# EAGLE design PIO-Breakout (EAGLE 9.5.2)
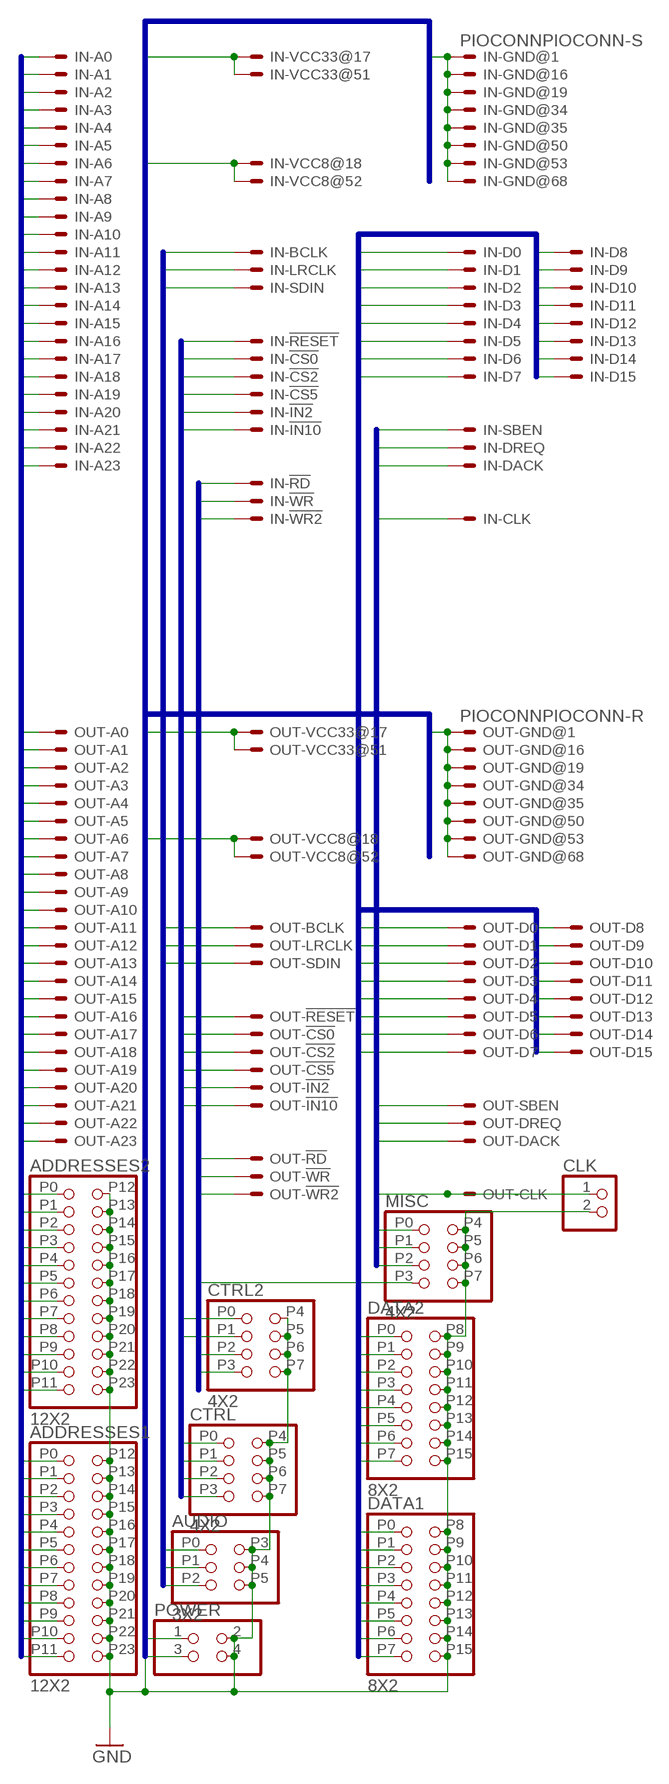
[diagram p0: schematic, sheet 1]

## Parts
ADDRESSES1  12X2  [12X2]
ADDRESSES2  12X2  [12X2]
AUDIO  3X2  [3X2]
CLK  PINHD-1X2  [1X02]
CTRL  4X2  [4X2]
CTRL2  4X2  [4X2]
DATA1  8X2  [8X2]
DATA2  8X2  [8X2]
IN  PIOCONNPIOCONN-S  [PIOCONN]
MISC  4X2  [4X2]
OUT  PIOCONNPIOCONN-R  [PIOCONN-R]
POWER  PINHD-2X2  [2X02]

## Nets
+3V3: IN.17 IN.51 OUT.17 OUT.51 POWER.3
+8V: IN.18 IN.52 OUT.18 OUT.52 POWER.1
A0: ADDRESSES1.P11 IN.14 OUT.14
A1: ADDRESSES2.P11 IN.48 OUT.48
A2: ADDRESSES1.P10 IN.15 OUT.15
A3: ADDRESSES2.P10 IN.49 OUT.49
A4: ADDRESSES1.P9 IN.20 OUT.20
A5: ADDRESSES2.P9 IN.54 OUT.54
A6: ADDRESSES1.P8 IN.21 OUT.21
A7: ADDRESSES2.P8 IN.55 OUT.55
A8: ADDRESSES1.P7 IN.22 OUT.22
A9: ADDRESSES2.P7 IN.56 OUT.56
A10: ADDRESSES1.P6 IN.23 OUT.23
A11: ADDRESSES2.P6 IN.57 OUT.57
A12: ADDRESSES1.P5 IN.24 OUT.24
A13: ADDRESSES2.P5 IN.58 OUT.58
A14: ADDRESSES1.P4 IN.25 OUT.25
A15: ADDRESSES2.P4 IN.59 OUT.59
A16: ADDRESSES1.P3 IN.26 OUT.26
A17: ADDRESSES2.P3 IN.60 OUT.60
A18: ADDRESSES1.P2 IN.27 OUT.27
A19: ADDRESSES2.P2 IN.61 OUT.61
A20: ADDRESSES1.P1 IN.28 OUT.28
A21: ADDRESSES2.P1 IN.62 OUT.62
A22: ADDRESSES1.P0 IN.29 OUT.29
A23: ADDRESSES2.P0 IN.63 OUT.63
BCLK: AUDIO.P2 IN.33 OUT.33
CLK: CLK.1 IN.32 OUT.32
CS0: CTRL.P0 IN.4 OUT.4
CS2: CTRL.P1 IN.39 OUT.39
CS5: CTRL2.P0 IN.65 OUT.65
D0: DATA1.P7 IN.6 OUT.6
D1: DATA2.P7 IN.40 OUT.40
D2: DATA1.P6 IN.7 OUT.7
D3: DATA2.P6 IN.41 OUT.41
D4: DATA1.P5 IN.8 OUT.8
D5: DATA2.P5 IN.42 OUT.42
D6: DATA1.P4 IN.9 OUT.9
D7: DATA2.P4 IN.43 OUT.43
D8: DATA1.P3 IN.10 OUT.10
D9: DATA2.P3 IN.44 OUT.44
D10: DATA1.P2 IN.11 OUT.11
D11: DATA2.P2 IN.45 OUT.45
D12: DATA1.P1 IN.12 OUT.12
D13: DATA2.P1 IN.46 OUT.46
D14: DATA1.P0 IN.13 OUT.13
D15: DATA2.P0 IN.47 OUT.47
DACK: IN.36 MISC.P1 OUT.36
DREQ: IN.3 MISC.P2 OUT.3
GND: ADDRESSES1.P12 ADDRESSES1.P13 ADDRESSES1.P14 ADDRESSES1.P15 ADDRESSES1.P16 ADDRESSES1.P17 ADDRESSES1.P18 ADDRESSES1.P19 ADDRESSES1.P20 ADDRESSES1.P21 ADDRESSES1.P22 ADDRESSES1.P23 ADDRESSES2.P12 ADDRESSES2.P13 ADDRESSES2.P14 ADDRESSES2.P15 ADDRESSES2.P16 ADDRESSES2.P17 ADDRESSES2.P18 ADDRESSES2.P19 ADDRESSES2.P20 ADDRESSES2.P21 ADDRESSES2.P22 ADDRESSES2.P23 AUDIO.P3 AUDIO.P4 AUDIO.P5 CLK.2 CTRL2.P4 CTRL2.P5 CTRL2.P6 CTRL2.P7 CTRL.P4 CTRL.P5 CTRL.P6 CTRL.P7 DATA1.P8 DATA1.P9 DATA1.P10 DATA1.P11 DATA1.P12 DATA1.P13 DATA1.P14 DATA1.P15 DATA2.P8 DATA2.P9 DATA2.P10 DATA2.P11 DATA2.P12 DATA2.P13 DATA2.P14 DATA2.P15 IN.1 IN.16 IN.19 IN.34 IN.35 IN.50 IN.53 IN.68 MISC.P4 MISC.P5 MISC.P6 MISC.P7 OUT.1 OUT.16 OUT.19 OUT.34 OUT.35 OUT.50 OUT.53 OUT.68 POWER.2 POWER.4
IN2: CTRL2.P1 IN.31 OUT.31
IN10: CTRL.P2 IN.37 OUT.37
LRCLK: AUDIO.P1 IN.66 OUT.66
RD: CTRL2.P2 IN.30 OUT.30
RESET: CTRL.P3 IN.2 OUT.2
SBEN: IN.5 MISC.P0 OUT.5
SDIN: AUDIO.P0 IN.67 OUT.67
WR: CTRL2.P3 IN.64 OUT.64
WR2: IN.38 MISC.P3 OUT.38

## Buses
A0,A1,A2,A3,A4,A5,A6,A7,A8,A9,A10,A11,A12,A13,A14,A15,A16,A17,A18,A19,A20,A21,A22,A23
+3V3,+8V,GND
BCLK,LRCLK,SDIN
CS0,CS2,CS5,IN2,IN10,RESET
RD,WR,WR2
D0,D1,D2,D3,D4,D5,D6,D7,D8,D9,D10,D11,D12,D13,D14,D15
CLK,DACK,DREQ,SBEN

## Library data of the parts
ADDRESSES1 ADDRESSES2 = pixel:12X2
AUDIO = pixel:3X2
CLK = pinhead:PINHD-1X2: PIN HEADER
CTRL CTRL2 MISC = pixel:4X2
DATA1 DATA2 = pixel:8X2
IN = pixel:PIOCONN: CONNECTOR 68-pin 1.27mm (.050 inch) pitch SCSI+ unshielded receptacle right angle all plastic
OUT = pixel:PIOCONN: CONNECTOR 68-pin 1.27mm (.050 inch) pitch SCSI+ unshielded receptacle right angle all plastic; MF: MOLEX; OC_FARNELL: unknown; OC_NEWARK: unknown
POWER = pinhead:PINHD-2X2: PIN HEADER

## Board
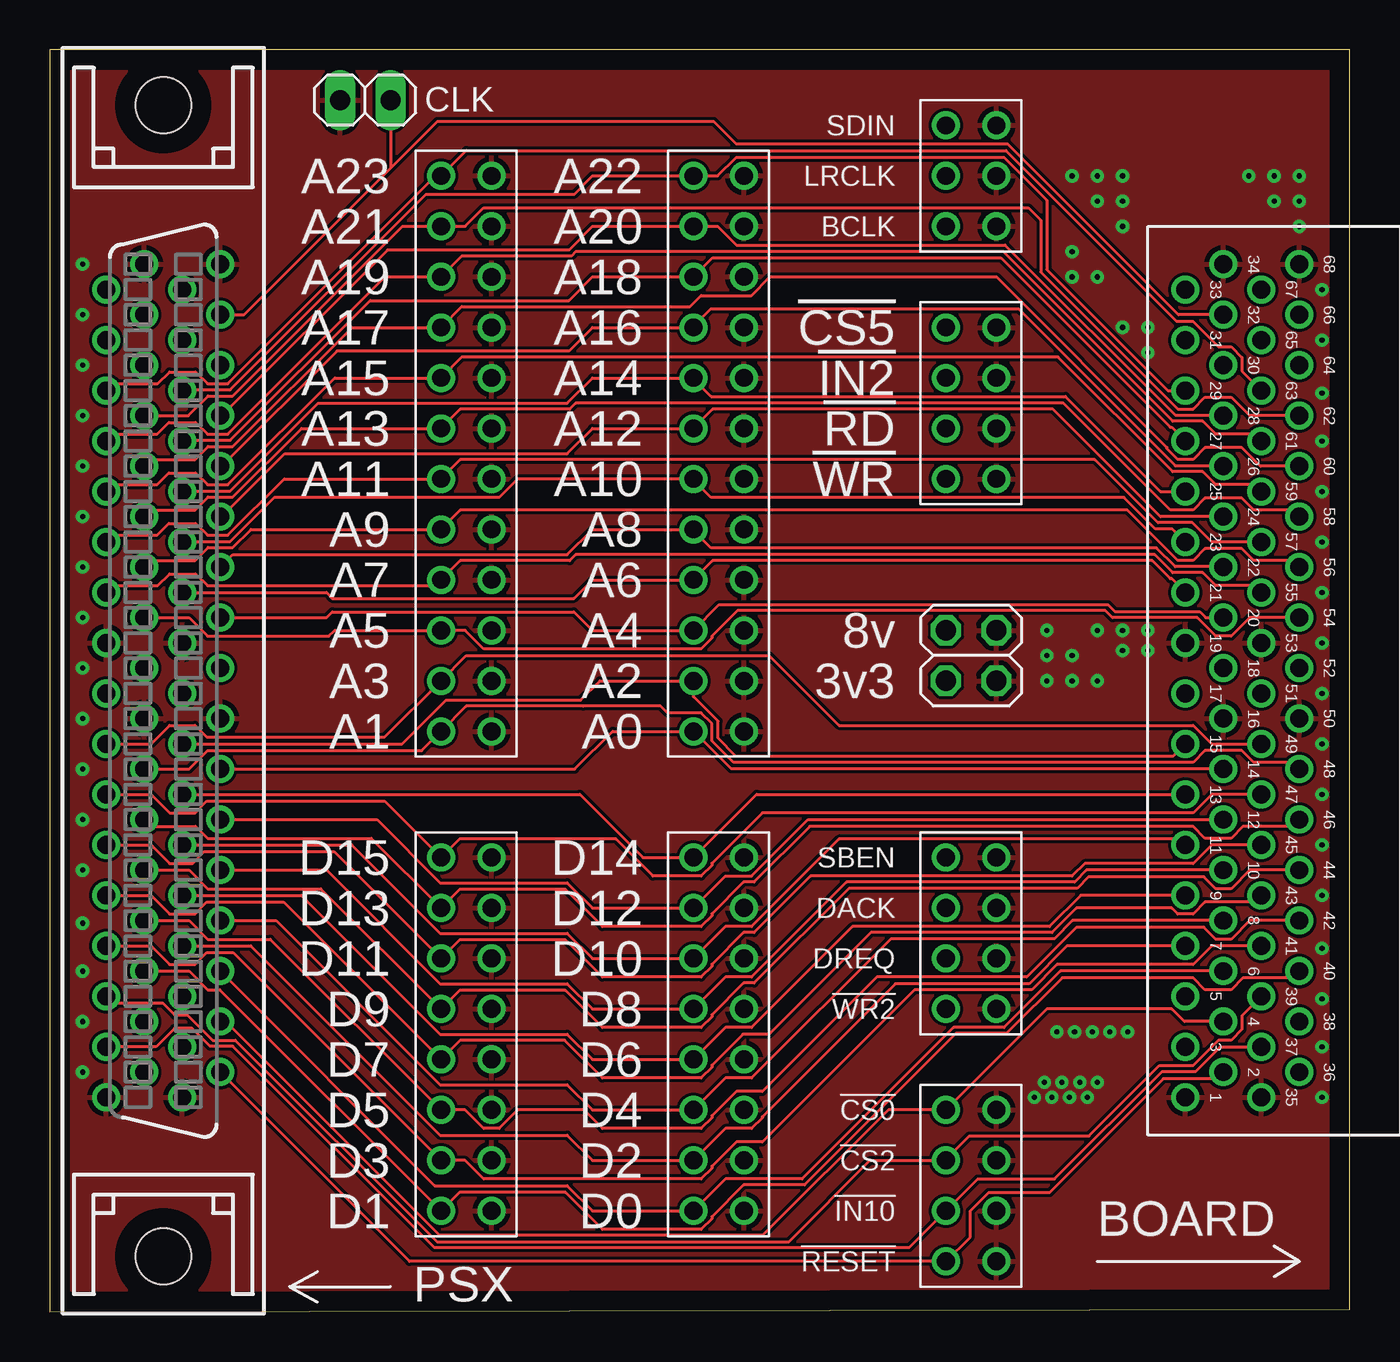
[diagram p1: board, top side]
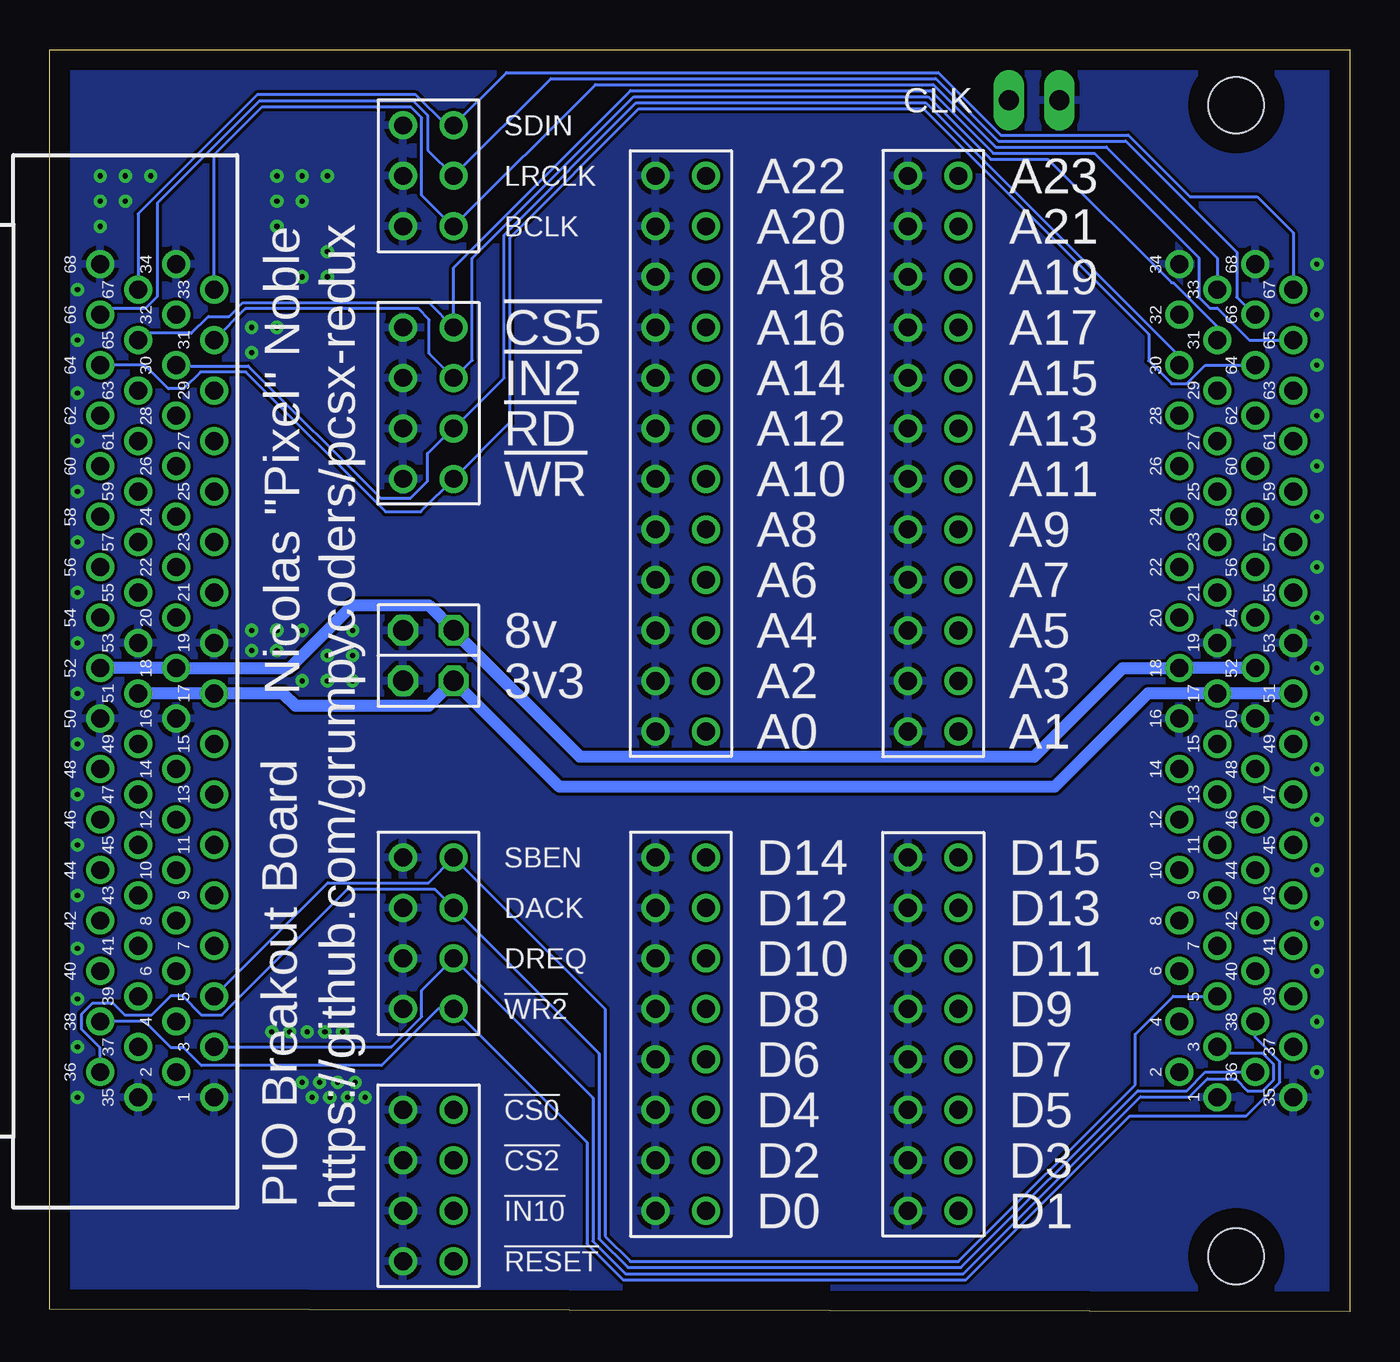
[diagram p2: board, bottom side, seen from below]

Size 65.41 x 63.5 mm. Coordinates in mm from the lower left corner, seen from the top.
Outline: 0,0 65.41,0.13 65.41,63.5 0,63.5 0,0
Copper layers (1*16): Top 0.035mm / dielectric 1.5mm / Bottom 0.035mm
Design rules "default *": minimum track width 6mil, minimum drill 10mil, track to track 6mil, track to pad 6mil, pad to pad 6mil, via to via 6mil, smd to smd 6mil, copper to edge 40mil, drill to drill 6mil, minimum pad ring 10mil, minimum via ring 8mil, stop-mask expansion 4mil, vias tented up to drill 25mil, thermal gap 10mil

### Footprints (pad centres in the part's own frame; a part is rotated, then mirrored left to right if it is on the bottom)
12X2 = drill 0.9 pad 1.27: P0 -1.27,13.97; P1 -1.27,11.43; P2 -1.27,8.89; P3 -1.27,6.35; P4 -1.27,3.81; P5 -1.27,1.27; P6 -1.27,-1.27; P7 -1.27,-3.81; P8 -1.27,-6.35; P9 -1.27,-8.89; P10 -1.27,-11.43; P11 -1.27,-13.97; P12 1.27,-13.97; P13 1.27,-11.43; P14 1.27,-8.89; P15 1.27,-6.35; P16 1.27,-3.81; P17 1.27,-1.27; P18 1.27,1.27; P19 1.27,3.81; P20 1.27,6.35; P21 1.27,8.89; P22 1.27,11.43; P23 1.27,13.97
3X2 = drill 0.9 pad 1.27: P0 -1.27,2.54; P1 -1.27,0; P2 -1.27,-2.54; P3 1.27,-2.54; P4 1.27,0; P5 1.27,2.54
1X02 = drill 1.016 long: 1 -1.27,0; 2 1.27,0
4X2 = drill 0.9 pad 1.27: P0 -1.27,3.81; P1 -1.27,1.27; P2 -1.27,-1.27; P3 -1.27,-3.81; P4 1.27,-3.81; P5 1.27,-1.27; P6 1.27,1.27; P7 1.27,3.81
8X2 = drill 0.9 pad 1.27: P0 -1.27,8.89; P1 -1.27,6.35; P2 -1.27,3.81; P3 -1.27,1.27; P4 -1.27,-1.27; P5 -1.27,-3.81; P6 -1.27,-6.35; P7 -1.27,-8.89; P8 1.27,-8.89; P9 1.27,-6.35; P10 1.27,-3.81; P11 1.27,-1.27; P12 1.27,1.27; P13 1.27,3.81; P14 1.27,6.35; P15 1.27,8.89
PIOCONN = drill 0.9 pad 1.27: 1 20.955,0.953; 2 19.685,2.863; 3 18.415,0.953; 4 17.145,2.863; 5 15.875,0.953; 6 14.605,2.863; 7 13.335,0.953; 8 12.065,2.863; 9 10.795,0.953; 10 9.525,2.863; 11 8.255,0.953; 12 6.985,2.863; 13 5.715,0.953; 14 4.445,2.863; 15 3.175,0.953; 16 1.905,2.863; 17 0.635,0.953; 18 -0.635,2.863; 19 -1.905,0.953; 20 -3.175,2.863; 21 -4.445,0.953; 22 -5.715,2.863; 23 -6.985,0.953; 24 -8.255,2.863; 25 -9.525,0.953; 26 -10.795,2.863; 27 -12.065,0.953; 28 -13.335,2.863; 29 -14.605,0.953; 30 -15.875,2.863; 31 -17.145,0.953; 32 -18.415,2.863; 33 -19.685,0.953; 34 -20.955,2.863; 35 20.955,-2.867; 36 19.685,-0.957; 37 18.415,-2.867; 38 17.145,-0.957; 39 15.875,-2.867; 40 14.605,-0.957; 41 13.335,-2.867; 42 12.065,-0.957; 43 10.795,-2.867; 44 9.525,-0.957; 45 8.255,-2.867; 46 6.985,-0.957; 47 5.715,-2.867; 48 4.445,-0.957; 49 3.175,-2.867; 50 1.905,-0.957; 51 0.635,-2.867; 52 -0.635,-0.957; 53 -1.905,-2.867; 54 -3.175,-0.957; 55 -4.445,-2.867; 56 -5.715,-0.957; 57 -6.985,-2.867; 58 -8.255,-0.957; 59 -9.525,-2.867; 60 -10.795,-0.957; 61 -12.065,-2.867; 62 -13.335,-0.957; 63 -14.605,-2.867; 64 -15.875,-0.957; 65 -17.145,-2.867; 66 -18.415,-0.957; 67 -19.685,-2.867; 68 -20.955,-0.957 | hole 2.8: -28.955,0; 28.955,0
PIOCONN-R = drill 0.9 pad 1.27: 1 -20.955,-5.73; 2 -19.685,-3.82; 3 -18.415,-5.73; 4 -17.145,-3.82; 5 -15.875,-5.73; 6 -14.605,-3.82; 7 -13.335,-5.73; 8 -12.065,-3.82; 9 -10.795,-5.73; 10 -9.525,-3.82; 11 -8.255,-5.73; 12 -6.985,-3.82; 13 -5.715,-5.73; 14 -4.445,-3.82; 15 -3.175,-5.73; 16 -1.905,-3.82; 17 -0.635,-5.73; 18 0.635,-3.82; 19 1.905,-5.73; 20 3.175,-3.82; 21 4.445,-5.73; 22 5.715,-3.82; 23 6.985,-5.73; 24 8.255,-3.82; 25 9.525,-5.73; 26 10.795,-3.82; 27 12.065,-5.73; 28 13.335,-3.82; 29 14.605,-5.73; 30 15.875,-3.82; 31 17.145,-5.73; 32 18.415,-3.82; 33 19.685,-5.73; 34 20.955,-3.82; 35 -20.955,-1.91; 36 -19.685,0; 37 -18.415,-1.91; 38 -17.145,0; 39 -15.875,-1.91; 40 -14.605,0; 41 -13.335,-1.91; 42 -12.065,0; 43 -10.795,-1.91; 44 -9.525,0; 45 -8.255,-1.91; 46 -6.985,0; 47 -5.715,-1.91; 48 -4.445,0; 49 -3.175,-1.91; 50 -1.905,0; 51 -0.635,-1.91; 52 0.635,0; 53 1.905,-1.91; 54 3.175,0; 55 4.445,-1.91; 56 5.715,0; 57 6.985,-1.91; 58 8.255,0; 59 9.525,-1.91; 60 10.795,0; 61 12.065,-1.91; 62 13.335,0; 63 14.605,-1.91; 64 15.875,0; 65 17.145,-1.91; 66 18.415,0; 67 19.685,-1.91; 68 20.955,0
2X02 = drill 1.016 octagon: 1 -1.27,-1.27; 2 -1.27,1.27; 3 1.27,-1.27; 4 1.27,1.27

### Placement (x,y rotation side)
ADDRESSES1  33.66,43.18 0 top
ADDRESSES2  20.96,43.18 0 top
AUDIO  46.35,57.15 0 top
CLK  15.88,60.96 180 top
CTRL  46.35,6.35 0 top
CTRL2  46.35,45.72 0 top
DATA1  33.66,13.97 0 top
DATA2  20.96,13.97 0 top
IN  5.71,31.75 270 top
MISC  46.35,19.05 0 top
OUT  62.86,31.75 90 bottom
POWER  46.35,33.02 270 top

### Tracks (layer width: path | path; a pad name or v marks a point on that pad's centre or on a via)
+3V3
  Bottom 0.61: IN.51 IN.17 10.16,31.11 14.86,26.42 39.75,26.42 POWER.3 46.33,30.5 53.04,30.5 53.65,31.11 OUT.17 OUT.51
+8V
  Bottom 0.61: IN.52 IN.18 11.43,32.38 15.88,27.94 38.73,27.94 POWER.1 46.35,35.56 50.16,35.56 53.34,32.38 OUT.18 OUT.52
A0
  Top 0.152: IN.14 26.42,27.3 28.32,29.21 ADDRESSES1.P11 32.41,29.21 33.67,27.95 34.28,27.34 59.01,27.34 OUT.14
A1
  Top 0.152: IN.48 7,27.3 7.94,28.24 18.71,28.24 ADDRESSES2.P11 20.95,30.47 26.84,30.47 26.85,30.48 30.73,30.48 31.07,30.14 32.77,30.14 33.32,29.6 33.32,28.73 34.41,27.64 57.52,27.64 58.12,28.24 59.97,28.24 60.57,27.64 62.53,27.64 OUT.48
A2
  Top 0.152: IN.15 17.73,28.57 19.93,30.78 26.71,30.78 27.69,31.75 ADDRESSES1.P10 32.38,30.96 33.62,29.72 33.62,28.86 34.54,27.95 56.51,27.95 OUT.15
A3
  Top 0.152: IN.49 5.09,28.57 6.03,29.51 7.31,29.51 7.9,28.91 16.85,28.91 ADDRESSES2.P10 20.96,33.02 36.2,33.02 39.71,29.51 57.52,29.51 58.45,28.57 OUT.49
A4
  Top 0.152: IN.20 13.92,34.92 14.22,35.22 26.37,35.22 27.31,34.29 ADDRESSES1.P9 33.68,35.59 53.24,35.59 53.6,35.23 57.85,35.23 58.16,34.92 OUT.20
A5
  Top 0.152: IN.54 7,34.92 7.94,33.99 14.04,33.99 14.34,34.29 ADDRESSES2.P9 20.91,34.29 21.84,33.36 32.77,33.36 33.32,33.9 33.32,34 34.6,35.28 53.11,35.28 53.47,34.92 57.73,34.92 58.66,33.99 59.43,33.99 60.36,34.92 OUT.54
A6
  Top 0.152: IN.21 13.92,36.2 14.22,35.9 26.37,35.9 27.31,36.83 ADDRESSES1.P8 33.35,37.8 55.46,37.8 56.37,36.89 56.44,36.89 OUT.21
A7
  Top 0.152: IN.55 3.18,36.53 5.43,36.53 6.03,37.13 7.34,37.13 7.94,36.53 19.38,36.53 ADDRESSES2.P8 20.65,37.8 26.16,37.8 26.47,38.1 55.59,38.1 56.5,37.19 58,37.19 58.66,36.53 60.62,36.53 OUT.55
A8
  Top 0.152: IN.22 9.21,38.1 26.04,38.1 27.31,39.37 ADDRESSES1.P7 32.38,39.32 33.27,38.44 55.68,38.44 56.62,37.5 59.01,37.5 OUT.22
A9
  Top 0.152: IN.56 5.09,37.8 7.31,37.8 7.97,38.46 9.22,38.46 10.12,39.37 ADDRESSES2.P7 20.65,40.34 54.22,40.34 56.75,37.8 57.52,37.8 58.12,38.4 59.97,38.4 60.57,37.8 62.53,37.8 OUT.56
A10
  Top 0.152: IN.23 6.7,38.77 9.09,38.77 11.3,40.98 22.61,40.98 23.54,41.91 ADDRESSES1.P6 32.38,41.86 33.27,40.98 54.04,40.98 55.63,39.4 56.48,39.4 OUT.23
A11
  Top 0.152: IN.57 3.18,39.07 5.4,39.07 5.99,39.67 7.34,39.67 7.94,39.07 8.96,39.07 11.8,41.91 ADDRESSES2.P6 20.65,42.88 52.58,42.88 55.75,39.7 57.49,39.7 58.45,38.73 OUT.57
A12
  Top 0.152: IN.24 8.65,40.01 11.82,43.18 26.04,43.18 27.31,44.45 ADDRESSES1.P5 33.35,45.41 50.47,45.41 55.88,40.01 OUT.24
A13
  Top 0.152: IN.58 5.09,40.34 7.31,40.34 7.97,41 9.22,41 12.66,44.45 ADDRESSES2.P5 20.65,45.41 26.16,45.41 26.47,45.72 51,45.72 56.38,40.34 57.52,40.34 58.12,40.94 59.97,40.94 60.57,40.34 62.53,40.34 OUT.58
A14
  Top 0.152: IN.25 6.7,41.31 9.09,41.31 13.5,45.72 26.04,45.72 27.31,46.99 ADDRESSES1.P4 32.38,46.94 33.27,46.06 51.1,46.06 55.88,41.27 OUT.25
A15
  Top 0.152: IN.59 3.18,41.61 5.4,41.61 5.99,42.21 7.34,42.21 7.94,41.61 8.96,41.61 14.34,46.99 ADDRESSES2.P4 20.73,48.04 50.73,48.04 56.5,42.27 58,42.27 58.66,41.61 60.62,41.61 OUT.59
A16
  Top 0.152: IN.26 8.65,42.55 14.45,48.34 26.12,48.34 27.31,49.53 ADDRESSES1.P3 32.38,49.58 33.27,50.46 48.74,50.46 56.62,42.58 59.01,42.58 OUT.26
A17
  Top 0.152: IN.60 5.09,42.88 7.31,42.88 7.97,43.54 9.22,43.54 15.2,49.53 ADDRESSES2.P3 20.73,50.58 32.21,50.58 32.77,51.14 35.31,51.14 36.24,52.07 47.62,52.07 56.2,43.49 56.2,43.43 56.75,42.88 57.52,42.88 58.12,43.48 59.97,43.48 60.91,42.55 OUT.60
A18
  Top 0.152: IN.27 6.7,43.85 9.09,43.85 16.13,50.88 26.12,50.88 27.31,52.07 ADDRESSES1.P2 33.35,53.03 47.84,53.03 56.37,44.51 56.44,44.51 OUT.27
A19
  Top 0.152: IN.61 3.18,44.15 5.4,44.15 5.99,44.75 7.34,44.75 7.94,44.15 8.96,44.15 16.88,52.07 ADDRESSES2.P2 20.73,53.12 26.25,53.12 26.47,53.34 47.97,53.34 56.5,44.81 58,44.81 58.66,44.15 60.62,44.15 OUT.61
A20
  Top 0.152: IN.28 8.65,45.09 16.99,53.42 26.12,53.42 27.31,54.61 ADDRESSES1.P1 33.61,54.61 34.54,53.68 48.06,53.68 56.62,45.12 59.01,45.12 OUT.28
A21
  Top 0.152: IN.62 6.97,45.09 7.97,46.08 9.22,46.08 17.74,54.61 ADDRESSES2.P1 20.91,54.61 21.84,55.54 49.23,55.54 49.86,54.91 49.86,52.31 56.75,45.42 57.52,45.42 58.12,46.02 59.43,46.02 60.36,45.09 OUT.62
A22
  Top 0.152: IN.29 6.7,46.39 9.09,46.39 18.92,56.22 26.37,56.22 27.31,57.15 ADDRESSES1.P0 33.61,57.15 34.54,58.08 48.01,58.08 50.16,55.93 50.16,52.44 56.25,46.35 OUT.29
A23
  Top 0.152: IN.63 3.18,46.69 5.43,46.69 6.03,47.29 7.34,47.29 7.94,46.69 8.96,46.69 19.42,57.15 ADDRESSES2.P0 20.96,58.42 48.1,58.42 56.7,49.83 57.52,49.83 58.79,48.56 59.43,48.56 59.98,48.01 59.98,47.33 OUT.63
BCLK
  Bottom 0.152: IN.33 6.67,53.02 12.24,58.6 17.81,58.6 20.95,61.74 37.95,61.74 AUDIO.P2 45.13,54.61 46.69,56.17 46.69,60.08 47.24,60.62 54.72,60.62 57.13,58.21 OUT.33
CLK
  Top 0.152: 17.15,57.53 9.78,50.16 IN.32 | 17.15,57.53 19.5,59.88 33.42,59.88 34.54,58.76 48.2,58.76 56.79,50.16 OUT.32 | CLK.1 17.15,57.53
CS0
  Top 0.152: IN.4 8.84,14.61 19.6,3.84 35.87,3.84 42.19,10.16 CTRL.P0 50.16,15.24 56.45,15.24 57.09,14.61 OUT.4
CS2
  Top 0.152: IN.39 3.18,15.54 5.69,15.54 6.28,14.94 6.92,14.94 8.19,13.67 9.34,13.67 19.48,3.54 37.19,3.54 41.27,7.62 CTRL.P1 45.09,7.67 46.26,8.85 52.28,8.85 55.84,12.4 57.52,12.4 58.79,13.67 59.43,13.67 59.98,14.22 59.98,14.9 OUT.39
CS5
  Bottom 0.152: OUT.65 60.62,49.23 58.28,49.23 57.43,50.08 56.38,50.08 55.69,50.77 46.32,50.77 CTRL2.P0 45.09,52.55 36.2,61.44 21.08,61.44 17.93,58.29 12.85,58.29 7.6,53.05 7.6,51.05 7.05,50.5 6.67,50.5 5.06,48.9 IN.65
D0
  Top 0.152: IN.6 19.37,6.35 26.04,6.35 27.31,5.08 DATA1.P7 33.99,6.69 37.85,6.69 45.47,14.31 48.01,14.31 50.85,17.14 OUT.6
D1
  Top 0.152: IN.40 7,17.14 7.94,16.21 8.55,16.21 DATA2.P7 20.62,6.01 25.94,6.01 27.81,4.15 32.77,4.15 33.32,4.69 33.32,4.79 34.91,6.38 37.98,6.38 45.6,14 48.14,14 50.94,16.81 57.52,16.81 58.12,16.21 59.43,16.21 60.03,16.81 62.53,16.81 OUT.40
D2
  Top 0.152: IN.7 10.11,18.41 19.64,8.89 26.04,8.89 27.31,7.62 DATA1.P6 33.99,9.23 35.31,9.23 35.86,9.77 35.86,9.82 42.54,16.51 49.28,16.51 51.18,18.41 OUT.7
D3
  Top 0.152: IN.41 5.09,18.41 6.03,17.48 7.31,17.48 7.9,18.08 9.23,18.08 DATA2.P6 20.91,7.62 21.84,6.69 32.77,6.69 33.32,7.23 33.32,7.33 34.54,8.55 35.86,8.55 43.51,16.2 49.4,16.2 50.68,17.48 57.52,17.48 58.45,18.41 OUT.41
D4
  Top 0.152: IN.8 11.38,19.68 19.64,11.43 26.04,11.43 27.31,10.16 DATA1.P5 33.99,11.77 35.31,11.77 42.32,18.78 50.55,18.78 51.46,19.68 OUT.8
D5
  Top 0.152: IN.42 7,19.68 7.94,18.75 11.09,18.75 DATA2.P5 20.91,10.16 21.84,9.23 22.61,9.23 23.54,10.16 26.87,10.16 27.81,9.23 32.77,9.23 33.32,9.77 33.32,9.87 34.54,11.09 35.86,11.09 41.61,16.85 49.15,16.85 51.66,19.35 58.06,19.35 58.66,18.75 59.43,18.75 60.36,19.68 OUT.42
D6
  Top 0.152: IN.9 12.65,20.95 19.64,13.97 26.04,13.97 27.31,12.7 DATA1.P4 33.99,14.31 35.31,14.31 40.39,19.39 50.3,19.39 51.86,20.95 OUT.9
D7
  Top 0.152: IN.43 5.09,20.95 6.03,20.02 7.31,20.02 7.9,20.62 11.77,20.62 DATA2.P4 20.65,13.66 25.91,13.66 27.81,11.77 32.77,11.77 33.32,12.31 33.32,12.41 34.88,13.97 36.2,13.97 41.31,19.08 50.42,19.08 51.66,20.32 56.45,20.32 56.75,20.02 57.52,20.02 58.12,20.62 60.62,20.62 OUT.43
D8
  Top 0.152: IN.10 13.92,22.23 19.64,16.51 26.04,16.51 27.31,15.24 DATA1.P3 33.99,16.85 35.31,16.85 40.09,21.62 51.56,21.62 52.16,22.23 OUT.10
D9
  Top 0.152: IN.44 7,22.23 7.94,21.29 13.63,21.29 DATA2.P3 20.62,16.17 25.94,16.17 27.81,14.31 32.77,14.31 33.32,14.85 33.32,14.95 34.91,16.54 35.44,16.54 40.21,21.32 51.69,21.32 52.26,21.89 58.06,21.89 58.66,21.29 59.43,21.29 60.36,22.23 OUT.44
D10
  Top 0.152: IN.11 15.19,23.5 19.64,19.05 26.04,19.05 27.31,17.78 DATA1.P2 33.99,19.39 35.31,19.39 39.72,23.79 56.77,23.79 57.07,23.5 OUT.11
D11
  Top 0.152: IN.45 5.09,23.5 6.03,22.56 7.18,22.56 7.78,23.16 14.31,23.16 DATA2.P2 20.62,18.71 25.94,18.71 27.81,16.85 32.77,16.85 33.32,17.39 33.32,17.49 34.91,19.08 35.44,19.08 38.28,21.93 51.43,21.93 52.07,22.56 57.52,22.56 58.45,23.5 OUT.45
D12
  Top 0.152: IN.12 16.46,24.77 19.64,21.59 26.04,21.59 27.31,20.32 DATA1.P1 33.99,21.93 35.31,21.93 38.15,24.77 OUT.12
D13
  Top 0.152: IN.46 5.09,24.43 7.34,24.43 7.94,23.83 16.17,23.83 DATA2.P1 20.62,21.25 25.94,21.25 27.81,19.39 32.77,19.39 33.32,19.93 33.32,20.03 34.91,21.62 35.44,21.62 38.24,24.43 57.52,24.43 58.12,23.83 59.43,23.83 60.03,24.43 62.53,24.43 OUT.46
D14
  Top 0.152: IN.13 26.67,26.04 29.85,22.86 DATA1.P0 35.56,26.04 OUT.13
D15
  Top 0.152: IN.47 5.09,26.04 6.03,25.1 7.31,25.1 7.9,25.7 16.85,25.7 DATA2.P0 20.62,23.79 28.48,23.79 30.35,21.93 32.77,21.93 33.32,22.47 33.32,22.57 35.85,25.1 57.52,25.1 58.45,26.04 OUT.47
DACK
  Bottom 0.152: OUT.36 62.86,13.29 63.8,14.22 63.8,14.99 63.25,15.54 62.23,15.54 61.63,14.94 60.28,14.94 59.3,15.92 58.75,15.92 57.77,14.94 56.75,14.94 50.44,21.25 46.02,21.25 MISC.P1 37.77,13.01 37.77,3.68 36.32,2.23 19.56,2.23 10.66,11.13 8.19,11.13 7.26,12.06 IN.36
DREQ
  Bottom 0.152: IN.3 6.33,13 4.37,13 3.83,12.45 3.83,11.68 4.37,11.13 5.14,11.13 5.74,11.73 7.17,11.73 8.06,10.83 10.54,10.83 19.43,1.93 36.45,1.93 38.07,3.56 38.07,10.77 MISC.P2 46.69,16.17 46.69,14.85 48.21,13.34 OUT.3
GND  (via drill 0.25)
  other vias: 50.67,14.1 51.56,14.1 52.45,14.1 53.34,14.1 54.23,14.1 50.04,11.56 49.53,10.79 50.42,10.79 50.93,11.56 51.31,10.79 51.82,11.56 52.2,10.79 52.7,11.56 50.16,34.29 50.16,33.02 51.43,33.02 50.16,31.75 51.43,31.75 52.7,31.75 52.7,34.29 53.98,34.29 55.24,34.29 55.24,33.27 53.98,33.27 51.43,57.15 52.7,57.15 53.98,57.15 53.98,55.88 52.7,55.88 53.98,54.61 60.32,57.15 61.59,57.15 62.86,57.15 61.59,55.88 62.86,54.61 62.86,55.88 55.24,49.53 55.24,48.26 53.98,49.53 52.7,52.07 51.43,52.07 51.43,53.34 1.65,52.7 1.65,50.16 1.65,47.62 1.65,45.09 1.65,42.55 1.65,40.01 1.65,37.47 1.65,34.92 1.65,32.38 1.65,29.84 1.65,27.3 1.65,24.77 1.65,22.23 1.65,19.56 1.65,17.14 1.65,14.61 1.65,12.06 64.01,51.44 64.01,48.9 64.01,46.23 64.01,43.81 64.01,41.27 64.01,38.73 64.01,36.2 64.01,33.66 64.01,31.11 64.01,28.57 64.01,26.04 64.01,23.5 64.01,20.95 64.01,18.29 64.01,15.75 64.01,13.34 64.01,10.79
  pour Bottom: 0.64,63.5 0.64,0 65.41,0 65.41,63.5
  pour Top: -0.64,63.5 65.41,63.5 65.41,0 -0.64,0
IN2
  Bottom 0.152: IN.31 6.67,49.57 8.87,51.77 8.96,51.77 15.18,57.99 18.06,57.99 21.2,61.13 36.02,61.13 44.15,53 44.15,47.87 45.04,46.99 CTRL2.P1 46.31,48.22 46.31,49.92 46.86,50.46 55.57,50.46 OUT.31
IN10
  Top 0.152: IN.37 5.35,13.34 6.28,14.27 7.17,14.27 8.06,13.37 9.22,13.37 19.35,3.23 43.24,3.23 CTRL.P2 46.69,6.69 50.55,6.69 55.96,12.1 57.65,12.1 58.88,13.34 OUT.37
LRCLK
  Bottom 0.152: IN.66 4.81,50.16 5.69,51.05 5.69,53.32 11.28,58.9 17.68,58.9 20.83,62.05 40.19,62.05 AUDIO.P1 46.39,58.45 46.39,60.2 47.11,60.93 54.85,60.93 59.98,55.8 59.98,51.09 60.57,50.5 62.53,50.5 OUT.66
RD
  Bottom 0.152: IN.30 8.58,48.08 21.33,60.83 35.9,60.83 42.54,54.18 42.54,46.99 CTRL2.P2 45.13,44.45 46.4,43.19 46.4,41.79 47.24,40.95 48.77,40.95 55.42,47.59 59.01,47.59 OUT.30
RESET
  Top 0.152: IN.2 18.1,2.54 CTRL.P3 46.31,3.77 46.31,5.08 47.24,6.01 50.31,6.01 56.02,11.73 58.71,11.73 OUT.2
SBEN
  Bottom 0.152: IN.5 8.89,15.88 10.79,13.97 10.79,11.43 19.69,2.54 36.2,2.54 37.46,3.81 37.46,15.24 MISC.P0 46.35,21.59 51.42,21.59 OUT.5
SDIN
  Bottom 0.152: OUT.67 60.95,55.25 54.97,61.23 46.99,61.23 45.44,59.69 AUDIO.P0 42.42,62.35 20.7,62.35 17.56,59.21 11.15,59.21 8.04,56.1 4.66,56.1 2.85,54.28 IN.67
WR
  Bottom 0.152: OUT.64 60.62,47.62 59.43,46.44 58.66,46.44 57.81,47.29 55.54,47.29 48.51,40.26 46.74,40.26 CTRL2.P3 42.24,44.76 42.24,54.05 35.77,60.52 21.46,60.52 10.12,49.19 10.12,47.85 8.96,46.69 8.19,46.69 7.26,47.62 IN.64
WR2
  Bottom 0.152: IN.38 4.76,13.81 3.52,12.58 3.52,11.55 5.21,9.86 11.07,9.86 19.31,1.63 36.57,1.63 38.38,3.43 38.38,8.53 MISC.P3 45.88,15.24 48.71,12.4 57.77,12.4 58.66,13.29 59.3,13.29 60.62,14.61 OUT.38

### Text on the board
tNames: SDIN | A23 | A22 | LRCLK | A21 | A20 | BCLK | 34 | 68 | A19 | A18 | 33 | 67 | A17 | A16 | !CS5 | 32 | 66 | 31 | 65 | 30 | 64 | A15 | A14 | !IN2 | 29 | 63 | 28 | 62 | A13 | A12 | !RD | 27 | 61 | 26 | 60 | A11 | A10 | !WR | 25 | 59 | 24 | 58 | A9 | A8 | 23 | 57 | A7 | A6 | 22 | 56 | 21 | 55 | 20 | 54 | A5 | A4 | 8v | 19 | 53 | A3 | A2 | 3v3 | 18 | 52 | 17 | 51 | 16 | 50 | A1 | A0 | 15 | 49 | 14 | 48 | 13 | 47 | 12 | 46 | D15 | D14 | SBEN | 11 | 45 | 10 | 44 | 9 | 43 | D13 | D12 | DACK | 8 | 42 | D11 | D10 | DREQ | 7 | 41 | 6 | 40 | 5 | 39 | D9 | D8 | !WR2 | 4 | 38 | D7 | D6 | 3 | 37 | 2 | 36 | 1 | 35 | D5 | D4 | !CS0 | D3 | D2 | !CS2 | D1 | D0 | !IN10 | BOARD | !RESET | PSX
bNames: CLK | SDIN | A23 | A22 | LRCLK | A21 | A20 | BCLK | https://github.com/grumpycoders/pcsx-redux | Nicolas "Pixel" Noble | 68 | 34 | 34 | 68 | A19 | A18 | 67 | 33 | 33 | 67 | 66 | 32 | A17 | A16 | !CS5 | 32 | 66 | 65 | 31 | 31 | 65 | 64 | 30 | 30 | 64 | A15 | A14 | !IN2 | 63 | 29 | 29 | 63 | 62 | 28 | 28 | 62 | 61 | 27 | A13 | A12 | !RD | 27 | 61 | 60 | 26 | 26 | 60 | A11 | A10 | !WR | 59 | 25 | 25 | 59 | 58 | 24 | 24 | 58 | 57 | 23 | A9 | A8 | 23 | 57 | 56 | 22 | A7 | A6 | 22 | 56 | 55 | 21 | 21 | 55 | 54 | 20 | 20 | 54 | 53 | 19 | A5 | A4 | 8v | 19 | 53 | 52 | 18 | A3 | A2 | 3v3 | 18 | 52 | 51 | 17 | 17 | 51 | 50 | 16 | 16 | 50 | 49 | 15 | A1 | A0 | 15 | 49 | PIO Breakout Board | 48 | 14 | 14 | 48 | 47 | 13 | 13 | 47 | 46 | 12 | 12 | 46 | 45 | 11 | D15 | D14 | SBEN | 11 | 45 | 44 | 10 | 10 | 44 | 43 | 9 | 9 | 43 | 42 | 8 | D13 | D12 | DACK | 8 | 42 | 41 | 7 | D11 | D10 | DREQ | 7 | 41 | 40 | 6 | 6 | 40 | 39 | 5 | 5 | 39 | 38 | 4 | D9 | D8 | !WR2 | 4 | 38 | 37 | 3 | D7 | D6 | 3 | 37 | 36 | 2 | 2 | 36 | 35 | 1 | 1 | 35 | D5 | D4 | !CS0 | D3 | D2 | !CS2 | D1 | D0 | !IN10 | !RESET